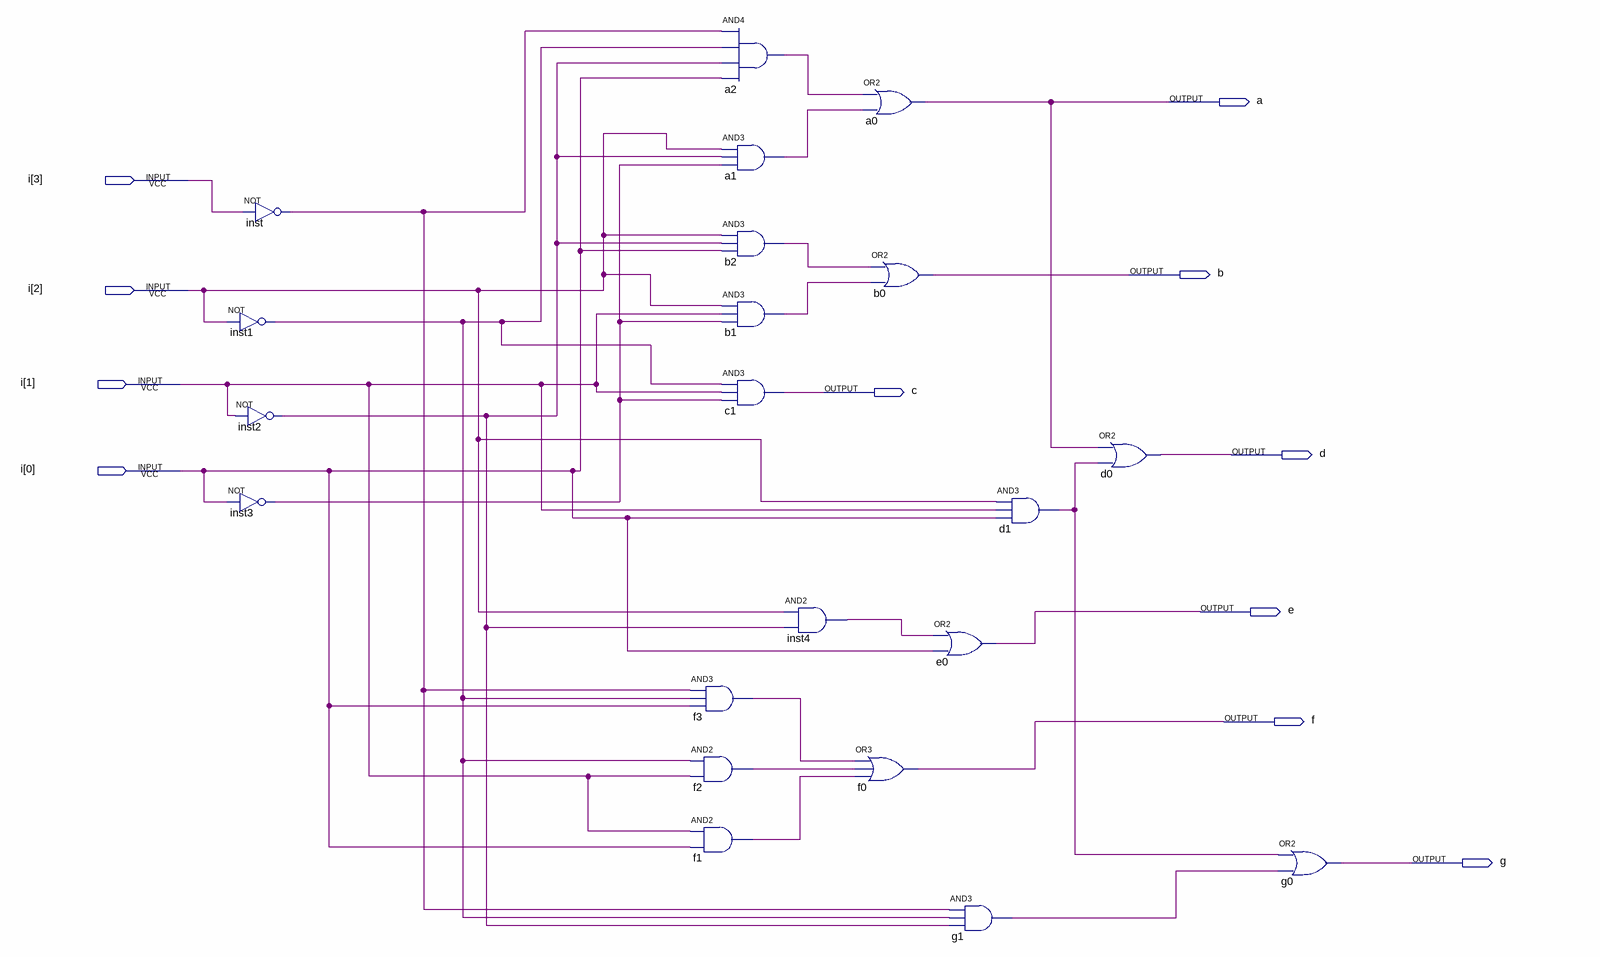
[diagram p0: schematic sheet]
// Quartus schematic display7 (2022_05_22 18_19_10 UTC).bdf as structural Verilog: 21 symbols, 11 pins
module \display7_(2022_05_22_18_19_10_UTC)  (
  input  [3:0] i,
  output a,
  output b,
  output c,
  output d,
  output e,
  output f,
  output g
);

  wire a1_out, a2_out, b1_out, b2_out, d1_out, f1_out, f2_out, f3_out, g1_out, inst1_out, inst2_out,
       inst3_out, inst4_out, inst_out;

  not inst (inst_out, i[3]);
  not inst1 (inst1_out, i[2]);
  not inst2 (inst2_out, i[1]);
  not inst3 (inst3_out, i[0]);
  and f3 (f3_out, inst_out, inst1_out, i[0]);
  and f2 (f2_out, inst1_out, i[1]);
  and f1 (f1_out, i[1], i[0]);
  and a2 (a2_out, inst_out, inst1_out, inst2_out, i[0]);
  and a1 (a1_out, i[2], inst2_out, inst3_out);
  and b2 (b2_out, i[2], inst2_out, i[0]);
  and b1 (b1_out, i[2], i[1], inst3_out);
  and c1 (c, inst1_out, i[1], inst3_out);
  and inst4 (inst4_out, i[2], inst2_out);
  or a0 (a, a2_out, a1_out);
  or b0 (b, b2_out, b1_out);
  or f0 (f, f3_out, f2_out, f1_out);
  or e0 (e, inst4_out, i[0]);
  and g1 (g1_out, inst_out, inst1_out, inst2_out);
  and d1 (d1_out, i[2], i[1], i[0]);
  or d0 (d, a, d1_out);
  or g0 (g, d1_out, g1_out);
endmodule
